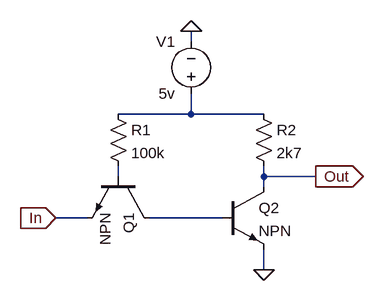
[diagram p0: schematic Draft5.asc]
Draft5.asc, the LTspice schematic file:
Version 4
SHEET 1 880 680
WIRE 208 -48 208 -64
WIRE 208 64 208 32
WIRE 208 64 96 64
WIRE 320 64 208 64
WIRE 96 160 96 144
WIRE 320 160 320 144
WIRE 400 160 320 160
WIRE 320 176 320 160
WIRE 48 224 0 224
WIRE 256 224 144 224
WIRE 320 304 320 272
FLAG 208 -64 0
FLAG 320 304 0
FLAG 0 224 In
IOPIN 0 224 In
FLAG 400 160 Out
IOPIN 400 160 Out
SYMBOL npn 144 160 R90
SYMATTR InstName Q1
SYMBOL npn 256 176 R0
SYMATTR InstName Q2
SYMBOL voltage 208 48 R180
WINDOW 0 24 96 Left 2
WINDOW 3 24 16 Left 2
WINDOW 123 0 0 Left 0
WINDOW 39 0 0 Left 0
SYMATTR InstName V1
SYMATTR Value 5v
SYMBOL res 80 48 R0
SYMATTR InstName R1
SYMATTR Value 100k
SYMBOL res 304 48 R0
SYMATTR InstName R2
SYMATTR Value 2k7

The netlist it stands for:
* Draft5.asc
Q1 N003 N002 In 0 NPN
Q2 Out N003 0 0 NPN
V1 N001 0 5v
R1 N001 N002 100k
R2 N001 Out 2k7
.model NPN NPN
.model PNP PNP
.lib standard.bjt
.backanno
.end